# EAGLE design Buffer (EAGLE 6.1)
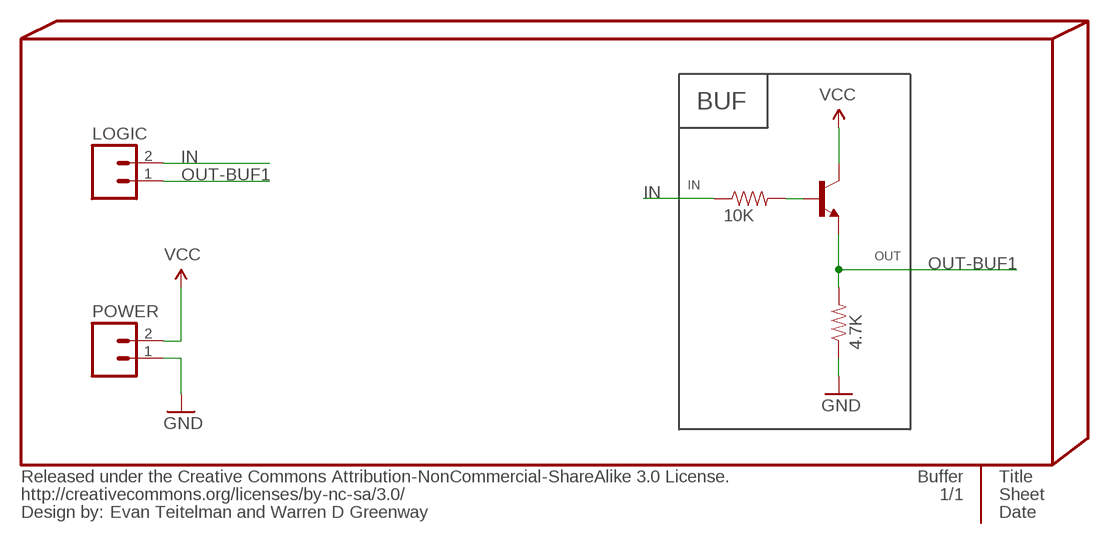
[diagram p0: schematic, sheet 1]

## Parts
INFO4  Evan Teitelman and Warren D Greenway  %CC-NC-SA  [%CC-NC-SA]
LOGIC  M02PTH  [1X02]
PDR-BUF1  4.7K  RESISTOR0402-RES  [0402-RES]
POWER  M02PTH  [1X02]
Q-BUF1  TRANSISTOR_NPNSOT23  [SOT23]
R-BUF1  10K  RESISTOR0402-RES  [0402-RES]

## Nets
GND: PDR-BUF1.1 POWER.1 ; supply symbol labelled @GND
IN: LOGIC.2 R-BUF1.1
N$4: Q-BUF1.1(B) R-BUF1.2
OUT-BUF1: LOGIC.1 PDR-BUF1.2 Q-BUF1.2(E)
VCC: POWER.2 Q-BUF1.3(C) ; supply symbol labelled @VCC

## Notes on the sheet
- BUF
- IN
- OUT

## Library data of the parts
INFO4 = PygmyBoards:%CC-NC-SA: Released under the Creative Commons Attribution-NonCommercial-ShareAlike 3.0 License. http://creativecommons.org/licenses/by-sa/3.0 Design by: [Designer Name] Change this part's value to change the designer name
LOGIC POWER = SparkFun:M02: Header 2 Standard 2-pin 0.1" header. Use with straight break away headers (SKU : PRT-00116), right angle break away headers (PRT-00553), swiss pins (PRT-00743), machine pins (PRT-00117), and female headers (PRT-00115). Molex polarized connector foot print use with SKU : PRT-08233 with associated crimp pins and housings.
PDR-BUF1 R-BUF1 = SparkFun:RESISTOR: Resistor Basic schematic elements and footprints for 0603, 1206, and PTH resistors.
Q-BUF1 = SparkFun:TRANSISTOR_NPN: Transistor NPN BJT configuration in SOT23 package. MMBT2222 is the common NPN we use. Double check BCE configuration again layout.

## Board
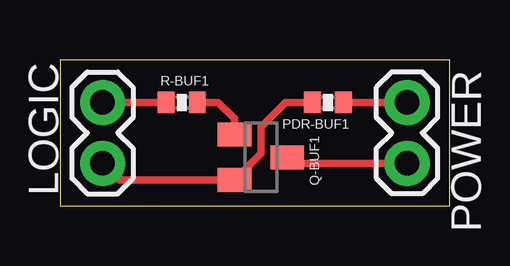
[diagram p1: board, top side]

Size 16.26 x 6.1 mm. Coordinates in mm from the lower left corner, seen from the top.
Outline: 0,0 16.26,0 16.26,6.1 0,6.1 0,0
Copper layers (1*16): Top 0.035mm / dielectric 1.5mm / Bottom 0.035mm
Design rules: minimum track width 6mil, minimum drill 13mil, track to track 6mil, track to pad 6mil, pad to pad 4mil, via to via 6mil, smd to smd 4mil, copper to edge 15mil, drill to drill 6mil, minimum pad ring 10mil, minimum via ring 8mil, stop-mask expansion 4mil, vias tented up to drill 25mil, thermal gap 10mil

### Footprints (pad centres in the part's own frame; a part is rotated, then mirrored left to right if it is on the bottom)
1X02 = drill 1.016 pad 1.88: 1 0,0; 2 2.54,0
0402-RES = smd 0.7 x 0.9: 1 -0.65,0; 2 0.65,0
SOT23 = smd 1 x 1.4: 1 -0.95,-1.1; 2 0.95,-1.1; 3 0,1.1

### Placement (x,y rotation side)
INFO4  0,-7.62 0 top  (outside the outline)
LOGIC  1.78,1.78 90 top
PDR-BUF1  11.18,4.32 180 top
POWER  14.48,4.32 270 top
Q-BUF1  8.38,2.03 270 top
R-BUF1  5.08,4.32 0 top

### Tracks (layer width: path | path; a pad name or v marks a point on that pad's centre or on a via)
GND
  Top 0.305: PDR-BUF1.1 POWER.1
IN
  Top 0.305: LOGIC.2 R-BUF1.1
N$4
  Top 0.305: Q-BUF1.1 7.28,3.64 6.6,4.32 R-BUF1.2
OUT-BUF1
  Top 0.305: PDR-BUF1.2 9.4,4.32 8.38,3.3 8.38,2.18 Q-BUF1.2 2.47,1.08 LOGIC.1
VCC
  Top 0.305: Q-BUF1.3 9.74,1.78 POWER.2

### Text on the board
_bsilk: AND | Out | In-B | Gnd | In-A | Vcc